# Altium schematic sheet S3C_SplitSPI.SchDoc
size A4; Organization: UltraZohm; SheetNumber: 12
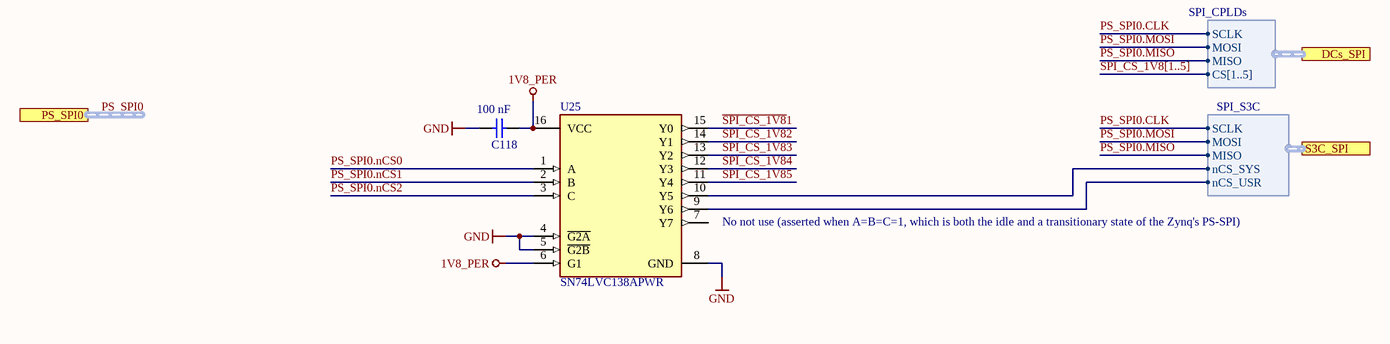
[diagram p0: S3C_SplitSPI.SchDoc]

## Parts
C118  100 nF  [C_0603_TE]
U25  SN74LVC138APWR  [TSSOP-16]

## Ports
DCs_SPI (harness SPI_CPLDs), PS_SPI0 (harness SPI), S3C_SPI (harness SPI_S3C)

## Harnesses
SPI_CPLDs: SCLK, MOSI, MISO, CS[1..5]
SPI_S3C: SCLK, MOSI, MISO, nCS_SYS, nCS_USR

## Nets
1V8_PER: C118.2 U25.6(G1) U25.16(VCC)
GND: C118.1 U25.4(~{G2A}) U25.5(~{G2B}) U25.8(GND)
PS_SPI0.CLK: port DCs_SPI.SCLK, port S3C_SPI.SCLK
PS_SPI0.MISO: port DCs_SPI.MISO, port S3C_SPI.MISO
PS_SPI0.MOSI: port DCs_SPI.MOSI, port S3C_SPI.MOSI
PS_SPI0.nCS0: U25.1(A)
PS_SPI0.nCS1: U25.2(B)
PS_SPI0.nCS2: U25.3(C)
~{SPI_CS_1V8}1: U25.15(Y0)
~{SPI_CS_1V8}2: U25.14(Y1)
~{SPI_CS_1V8}3: U25.13(Y2)
~{SPI_CS_1V8}4: U25.12(Y3)
~{SPI_CS_1V8}5: U25.11(Y4)
NetU25_9: U25.9(Y6) ; port S3C_SPI.nCS_USR
NetU25_10: U25.10(Y5) ; port S3C_SPI.nCS_SYS

Not connected (* = marked no-connect by the designer): U25 7(Y7)

## Buses and harness runs
bus ~{SPI_CS_1V8}[1..5]
harness PS_SPI0 = port PS_SPI0

## Notes on the sheet
- (near U25) No not use (asserted when A=B=C=1, which is both the idle and a transitionary state of the Zynq's PS-SPI)
- Title
- Revision:
- Design Engineer:
- Date:
- Project:
- Sheet
- of

## Library data of the parts
C118 = UZgen_C_0603_100nF_50V_X7R: Generic capacitor; Manufacturer: UZgen; Voltage: 50V; Tolerance: 10 %; Created from: AGeiger; Manufacturer Part Number: UZgen_C_0603_100nF_50V_X7R; PartID: 1; Created On: 02/07/2024 14:42:23; Value: 100 nF; Device Package: 0603; Technology: X7R; Mounting Type: SMD; Last Updated: 08/08/2024 15:01:15
U25 = SN74LVC138APWR: 3-Line to 8-Line Decoders Demultiplexers; Manufacturer: Texas Instruments; Created from: FRosner; ComponentLink2Description: Datasheet; ComponentLink2URL: http://www.ti.com/lit/ds/symlink/sn74lvc138a.pdf; Manufacturer Part Number: SN74LVC138APWR; PartID: 19; Created On: 05/09/2024 11:52:28; ComponentLink1Description: Datasheet; ComponentLink1URL: https://www.ti.com/lit/ds/symlink/sn74lvc138a.pdf?ts=1725532939575&ref_url=https%253A%252F%252Fwww.mouser.de%252F; Component Type: Decoders/Demultiplexers; Device Package: TSSOP-16; Last Updated: 05/09/2024 12:52:22; Mounting Type: SMD; Operating Temperature: -40 - 85 °C; Series: SN74LVC138A; Supplier 1: Mouser; Supplier Part Number 1: 595-SN74LVC138APWR; Supplier 2: LCSC; Supplier Part Number 2: C485077; Type: Decoders/Demultiplexers; Live Cycle Status: 1; LCSC Part Number: C485077; Stock number: not stored